# Altium schematic sheet First_Sheet.SCHDOC
size 297 x 209 mm
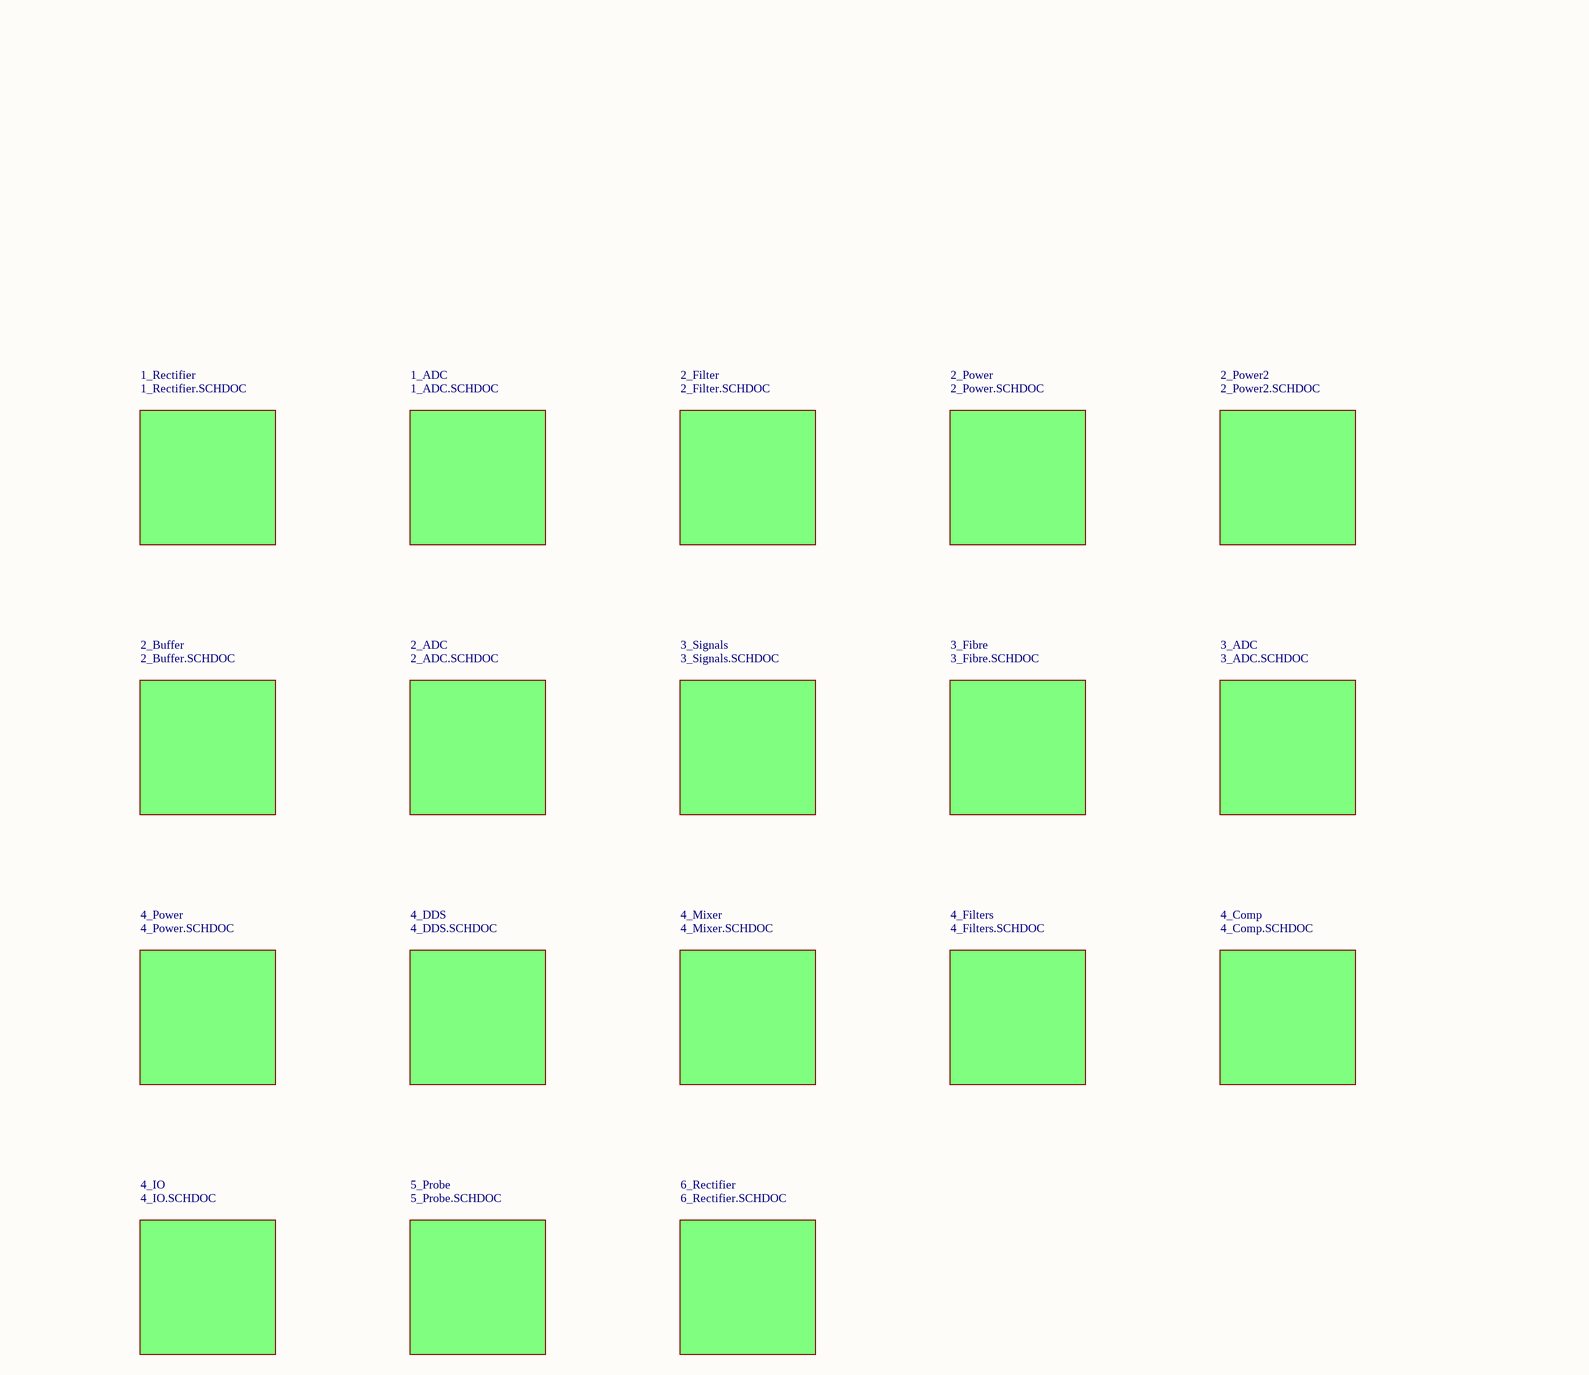
[diagram p0: First_Sheet.SCHDOC]

## Sub-sheets
1_ADC = 1_ADC.SCHDOC: no entries
1_Rectifier = 1_Rectifier.SCHDOC: no entries
2_ADC = 2_ADC.SCHDOC: no entries
2_Buffer = 2_Buffer.SCHDOC: no entries
2_Filter = 2_Filter.SCHDOC: no entries
2_Power = 2_Power.SCHDOC: no entries
2_Power2 = 2_Power2.SCHDOC: no entries
3_ADC = 3_ADC.SCHDOC: no entries
3_Fibre = 3_Fibre.SCHDOC: no entries
3_Signals = 3_Signals.SCHDOC: no entries
4_Comp = 4_Comp.SCHDOC: no entries
4_DDS = 4_DDS.SCHDOC: no entries
4_Filters = 4_Filters.SCHDOC: no entries
4_IO = 4_IO.SCHDOC: no entries
4_Mixer = 4_Mixer.SCHDOC: no entries
4_Power = 4_Power.SCHDOC: no entries
5_Probe = 5_Probe.SCHDOC: no entries
6_Rectifier = 6_Rectifier.SCHDOC: no entries